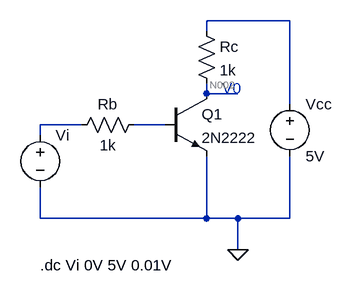
[diagram p0: schematic 1.2.1.asc]
1.2.1.asc, the LTspice schematic file:
Version 4
SHEET 1 880 680
WIRE 432 -32 304 -32
WIRE 304 -16 304 -32
WIRE 304 80 304 64
WIRE 352 80 304 80
WIRE 432 96 432 -32
WIRE 112 128 48 128
WIRE 240 128 192 128
WIRE 48 144 48 128
WIRE 48 272 48 224
WIRE 304 272 304 176
WIRE 304 272 48 272
WIRE 352 272 304 272
WIRE 432 272 432 176
WIRE 432 272 352 272
WIRE 352 320 352 272
FLAG 352 320 0
SYMBOL voltage 48 128 R0
SYMATTR InstName Vi
SYMATTR Value ""
SYMBOL npn 240 80 R0
SYMATTR InstName Q1
SYMATTR Value 2N2222
SYMBOL res 208 112 R90
WINDOW 0 0 56 VBottom 2
WINDOW 3 32 56 VTop 2
SYMATTR InstName Rb
SYMATTR Value 1k
SYMBOL voltage 432 80 R0
WINDOW 123 0 0 Left 0
WINDOW 39 0 0 Left 0
SYMATTR InstName Vcc
SYMATTR Value 5V
SYMBOL res 288 -32 R0
SYMATTR InstName Rc
SYMATTR Value 1k
TEXT 328 72 Left 2 ;V0
TEXT 48 344 Left 2 !.dc Vi 0V 5V 0.01V

The netlist it stands for:
* 1.2.1.asc
Vi N003 0
Q1 N002 N004 0 0 2N2222
Rb N004 N003 1k
Vcc N001 0 5V
Rc N001 N002 1k
.model NPN NPN
.model PNP PNP
.lib standard.bjt
* V0
.dc Vi 0V 5V 0.01V
.backanno
.end

* Results of the author's LTspice run, read from the files saved beside the schematic
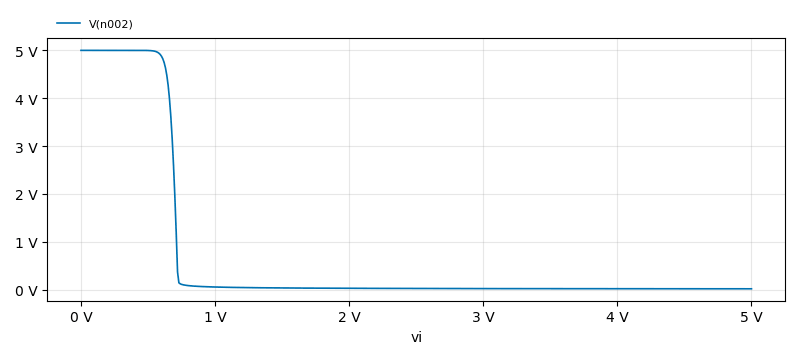
[diagram p1: DC transfer characteristic of 1.2.1.asc, plotted from the saved traces]
* DC transfer characteristic, 1 run:
*   V(n002): 5 V at vi=0 V, 18.45 mV at vi=5 V, min 18.45 mV, max 5 V